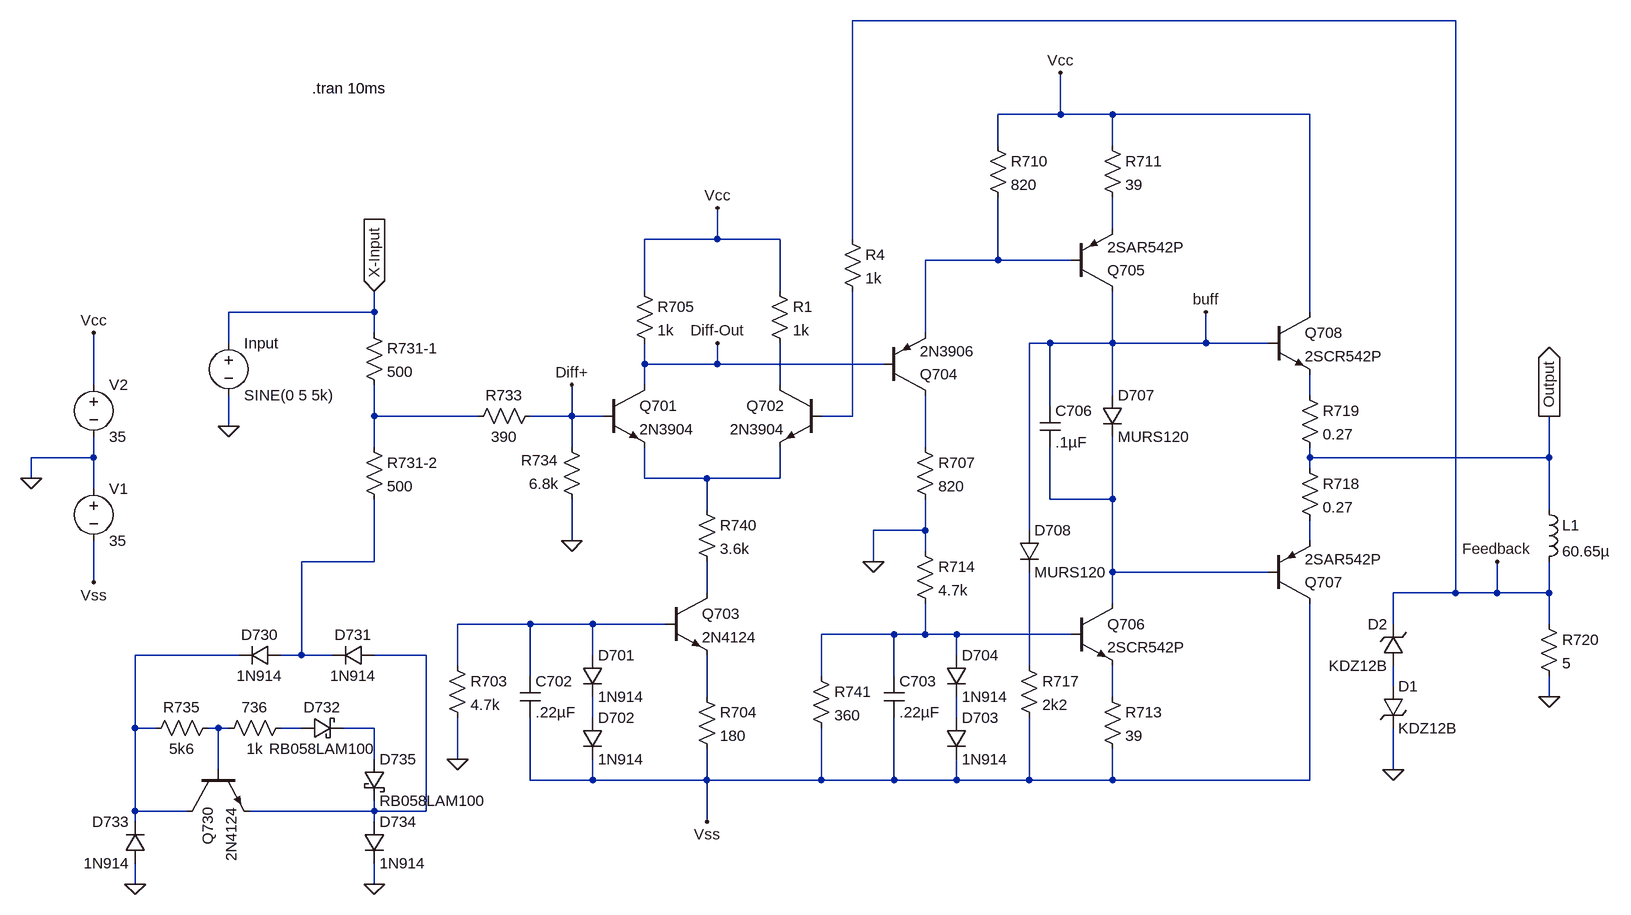
[diagram p0: schematic Atari Deflector X.asc]
Atari Deflector X.asc, the LTspice schematic file:
Version 4
SHEET 1 1880 912
WIRE 1632 -432 704 -432
WIRE 1024 -288 1024 -352
WIRE 1024 -288 928 -288
WIRE 1104 -288 1024 -288
WIRE 1408 -288 1104 -288
WIRE 928 -240 928 -288
WIRE 1104 -240 1104 -288
WIRE 1104 -112 1104 -160
WIRE 496 -96 496 -144
WIRE 496 -96 384 -96
WIRE 592 -96 496 -96
WIRE 704 -96 704 -432
WIRE 928 -64 928 -160
WIRE 928 -64 816 -64
WIRE 1040 -64 928 -64
WIRE 384 -16 384 -96
WIRE 592 -16 592 -96
WIRE -32 16 -32 -16
WIRE -32 16 -256 16
WIRE 1408 16 1408 -288
WIRE -32 48 -32 16
WIRE 816 48 816 -64
WIRE -256 64 -256 16
WIRE 1008 64 976 64
WIRE 1104 64 1104 -16
WIRE 1104 64 1008 64
WIRE 1248 64 1248 16
WIRE 1248 64 1104 64
WIRE 1344 64 1248 64
WIRE 384 96 384 64
WIRE 496 96 496 64
WIRE 496 96 384 96
WIRE 752 96 496 96
WIRE -464 128 -464 48
WIRE 384 128 384 96
WIRE 592 128 592 64
WIRE 1104 144 1104 64
WIRE 1408 144 1408 112
WIRE 1008 160 1008 64
WIRE -32 176 -32 128
WIRE 128 176 -32 176
WIRE 272 176 272 128
WIRE 272 176 208 176
WIRE 320 176 272 176
WIRE 704 176 704 -16
WIRE 704 176 656 176
WIRE -256 192 -256 144
WIRE -32 224 -32 176
WIRE 272 224 272 176
WIRE 816 224 816 144
WIRE -464 240 -464 208
WIRE -464 240 -560 240
WIRE 1408 240 1408 224
WIRE 1776 240 1776 176
WIRE 1776 240 1408 240
WIRE 1408 256 1408 240
WIRE -560 272 -560 240
WIRE 384 272 384 224
WIRE 480 272 384 272
WIRE 592 272 592 224
WIRE 592 272 480 272
WIRE -464 288 -464 240
WIRE 1008 304 1008 224
WIRE 1104 304 1104 208
WIRE 1104 304 1008 304
WIRE 480 320 480 272
WIRE 1776 320 1776 240
WIRE 816 352 816 304
WIRE 816 352 736 352
WIRE 976 352 976 64
WIRE 272 368 272 304
WIRE 1408 368 1408 336
WIRE 816 384 816 352
WIRE -32 400 -32 304
WIRE -32 400 -144 400
WIRE 736 400 736 352
WIRE 1104 416 1104 304
WIRE 1344 416 1104 416
WIRE -464 432 -464 368
WIRE 480 448 480 400
WIRE 1632 448 1632 -432
WIRE 1632 448 1536 448
WIRE 1696 448 1696 400
WIRE 1696 448 1632 448
WIRE 1776 448 1776 400
WIRE 1776 448 1696 448
WIRE 1104 464 1104 416
WIRE 208 496 96 496
WIRE 304 496 208 496
WIRE 416 496 304 496
WIRE 1536 496 1536 448
WIRE 1776 496 1776 448
WIRE 768 512 656 512
WIRE 816 512 816 464
WIRE 816 512 768 512
WIRE 864 512 816 512
WIRE 1040 512 864 512
WIRE -240 544 -400 544
WIRE -144 544 -144 400
WIRE -144 544 -176 544
WIRE -96 544 -144 544
WIRE 48 544 -32 544
WIRE 304 544 304 496
WIRE 864 544 864 512
WIRE 96 560 96 496
WIRE 976 560 976 416
WIRE 208 576 208 496
WIRE 656 576 656 512
WIRE 768 576 768 512
WIRE 1536 592 1536 560
WIRE 480 608 480 544
WIRE 1104 608 1104 560
WIRE 1776 608 1776 576
WIRE 304 640 304 608
WIRE 864 640 864 608
WIRE -400 656 -400 544
WIRE -368 656 -400 656
WIRE -272 656 -288 656
WIRE -256 656 -272 656
WIRE -144 656 -176 656
WIRE -32 656 -80 656
WIRE -32 704 -32 656
WIRE 96 704 96 640
WIRE -272 720 -272 656
WIRE 1536 720 1536 656
WIRE 208 736 208 640
WIRE 304 736 304 704
WIRE 304 736 208 736
WIRE 480 736 480 688
WIRE 480 736 304 736
WIRE 656 736 656 656
WIRE 656 736 480 736
WIRE 768 736 768 640
WIRE 768 736 656 736
WIRE 864 736 864 704
WIRE 864 736 768 736
WIRE 976 736 976 640
WIRE 976 736 864 736
WIRE 1104 736 1104 688
WIRE 1104 736 976 736
WIRE 1408 736 1408 464
WIRE 1408 736 1104 736
WIRE -400 784 -400 656
WIRE -320 784 -400 784
WIRE -32 784 -32 768
WIRE -32 784 -224 784
WIRE 48 784 48 544
WIRE 48 784 -32 784
WIRE -400 800 -400 784
WIRE -32 800 -32 784
WIRE 480 800 480 736
WIRE -400 896 -400 864
WIRE -32 896 -32 864
FLAG -560 272 0
FLAG -464 48 Vcc
FLAG -464 432 Vss
FLAG 480 800 Vss
FLAG 96 704 0
FLAG 496 -144 Vcc
FLAG 272 368 0
FLAG -32 -16 X-Input
IOPIN -32 -16 In
FLAG -400 896 0
FLAG -32 896 0
FLAG 736 400 0
FLAG 1024 -352 Vcc
FLAG 1776 608 0
FLAG 1776 176 Output
IOPIN 1776 176 Out
FLAG -256 192 0
FLAG 272 128 Diff+
FLAG 496 64 Diff-Out
FLAG 1248 16 buff
FLAG 1536 720 0
FLAG 1696 400 Feedback
SYMBOL npn 320 128 R0
SYMATTR InstName Q701
SYMATTR Value 2N3904
SYMBOL npn 656 128 M0
SYMATTR InstName Q702
SYMATTR Value 2N3904
SYMBOL npn 416 448 R0
SYMATTR InstName Q703
SYMATTR Value 2N4124
SYMBOL res 464 304 R0
SYMATTR InstName R740
SYMATTR Value 3.6k
SYMBOL res 464 592 R0
SYMATTR InstName R704
SYMATTR Value 180
SYMBOL voltage -464 272 R0
SYMATTR InstName V1
SYMATTR Value 35
SYMBOL voltage -464 112 R0
SYMATTR InstName V2
SYMATTR Value 35
SYMBOL diode 288 544 R0
SYMATTR InstName D701
SYMATTR Value 1N914
SYMBOL diode 288 640 R0
SYMATTR InstName D702
SYMATTR Value 1N914
SYMBOL res 80 544 R0
SYMATTR InstName R703
SYMATTR Value 4.7k
SYMBOL cap 192 576 R0
SYMATTR InstName C702
SYMATTR Value .22µF
SYMBOL res 368 -32 R0
SYMATTR InstName R705
SYMATTR Value 1k
SYMBOL res 576 -32 R0
SYMATTR InstName R1
SYMATTR Value 1k
SYMBOL res 288 320 R180
WINDOW 0 36 76 Left 2
WINDOW 3 36 40 Left 2
SYMATTR InstName R734
SYMATTR Value 6.8k
SYMBOL res 224 160 R90
WINDOW 0 0 56 VBottom 2
WINDOW 3 32 56 VTop 2
SYMATTR InstName R733
SYMATTR Value 390
SYMBOL res -48 32 R0
SYMATTR InstName R731-1
SYMATTR Value 500
SYMBOL res -48 208 R0
SYMATTR InstName R731-2
SYMATTR Value 500
SYMBOL diode -176 528 R90
WINDOW 0 0 32 VBottom 2
WINDOW 3 32 32 VTop 2
SYMATTR InstName D730
SYMATTR Value 1N914
SYMBOL diode -32 528 R90
WINDOW 0 0 32 VBottom 2
WINDOW 3 32 32 VTop 2
SYMATTR InstName D731
SYMATTR Value 1N914
SYMBOL diode -384 864 R180
WINDOW 0 24 64 Left 2
WINDOW 3 24 0 Left 2
SYMATTR InstName D733
SYMATTR Value 1N914
SYMBOL diode -48 800 R0
SYMATTR InstName D734
SYMATTR Value 1N914
SYMBOL schottky -144 672 R270
WINDOW 0 32 32 VTop 2
WINDOW 3 0 32 VBottom 2
SYMATTR InstName D732
SYMATTR Value RB058LAM100
SYMATTR Description Diode
SYMATTR Type diode
SYMBOL schottky -48 704 R0
SYMATTR InstName D735
SYMATTR Value RB058LAM100
SYMATTR Description Diode
SYMATTR Type diode
SYMBOL npn -320 720 M90
SYMATTR InstName Q730
SYMATTR Value 2N4124
SYMBOL res -272 640 R90
WINDOW 0 0 56 VBottom 2
WINDOW 3 32 56 VTop 2
SYMATTR InstName R735
SYMATTR Value 5k6
SYMBOL res -160 640 R90
WINDOW 0 0 56 VBottom 2
WINDOW 3 32 56 VTop 2
SYMATTR InstName 736
SYMATTR Value 1k
SYMBOL pnp 752 144 M180
SYMATTR InstName Q704
SYMATTR Value 2N3906
SYMBOL res 800 208 R0
SYMATTR InstName R707
SYMATTR Value 820
SYMBOL pnp 1040 -16 M180
SYMATTR InstName Q705
SYMATTR Value 2SAR542P
SYMBOL res 912 -256 R0
SYMATTR InstName R710
SYMATTR Value 820
SYMBOL res 1088 -256 R0
SYMATTR InstName R711
SYMATTR Value 39
SYMBOL diode 960 352 R0
SYMATTR InstName D708
SYMATTR Value MURS120
SYMBOL diode 1088 144 R0
SYMATTR InstName D707
SYMATTR Value MURS120
SYMBOL diode 848 544 R0
SYMATTR InstName D704
SYMATTR Value 1N914
SYMBOL diode 848 640 R0
SYMATTR InstName D703
SYMATTR Value 1N914
SYMBOL res 640 560 R0
SYMATTR InstName R741
SYMATTR Value 360
SYMBOL cap 752 576 R0
SYMATTR InstName C703
SYMATTR Value .22µF
SYMBOL npn 1040 464 R0
SYMATTR InstName Q706
SYMATTR Value 2SCR542P
SYMBOL res 960 544 R0
SYMATTR InstName R717
SYMATTR Value 2k2
SYMBOL cap 992 160 R0
SYMATTR InstName C706
SYMATTR Value .1µF
SYMBOL res 1088 592 R0
SYMATTR InstName R713
SYMATTR Value 39
SYMBOL pnp 1344 464 M180
SYMATTR InstName Q707
SYMATTR Value 2SAR542P
SYMBOL npn 1344 16 R0
SYMATTR InstName Q708
SYMATTR Value 2SCR542P
SYMBOL res 1392 128 R0
SYMATTR InstName R719
SYMATTR Value 0.27
SYMBOL res 1392 240 R0
SYMATTR InstName R718
SYMATTR Value 0.27
SYMBOL ind 1760 304 R0
SYMATTR InstName L1
SYMATTR Value 60.65µ
SYMBOL res 1760 480 R0
SYMATTR InstName R720
SYMATTR Value 5
SYMBOL voltage -256 48 R0
SYMATTR InstName Input
SYMATTR Value SINE(0 5 5k)
SYMBOL zener 1520 592 R0
SYMATTR InstName D1
SYMATTR Value KDZ12B
SYMATTR Description Diode
SYMATTR Type diode
SYMBOL zener 1552 560 R180
WINDOW 0 24 64 Left 2
WINDOW 3 24 0 Left 2
SYMATTR InstName D2
SYMATTR Value KDZ12B
SYMATTR Description Diode
SYMATTR Type diode
SYMBOL res 688 -112 R0
SYMATTR InstName R4
SYMATTR Value 1k
SYMBOL res 800 368 R0
SYMATTR InstName R714
SYMATTR Value 4.7k
TEXT -128 -328 Left 2 !.tran 10ms

The netlist it stands for:
* Atari Deflector X.asc
Q701 Diff-Out Diff+ N008 0 2N3904
Q702 N003 N006 N008 0 2N3904
Q703 N012 N013 N019 0 2N4124
R740 N008 N012 3.6k
R704 N019 Vss 180
V1 0 Vss 35
V2 Vcc 0 35
D701 N013 N021 1N914
D702 N021 Vss 1N914
R703 N013 0 4.7k
C702 N013 Vss .22µF
R705 Vcc Diff-Out 1k
R1 Vcc N003 1k
R734 0 Diff+ 6.8k
R733 Diff+ N005 390
R731-1 X-Input N005 500
R731-2 N005 N011 500
D730 N011 N015 1N914
D731 N016 N011 1N914
D733 0 N015 1N914
D734 N016 0 1N914
D732 N024 N025 RB058LAM100
D735 N025 N016 RB058LAM100
Q730 N015 N023 N016 0 2N4124
R735 N023 N015 5k6
R§736 N024 N023 1k
Q704 N007 Diff-Out N002 0 2N3906
R707 N007 0 820
Q705 buff N002 N001 0 2SAR542P
R710 Vcc N002 820
R711 Vcc N001 39
D708 buff N017 MURS120
D707 buff N009 MURS120
D704 N014 N022 1N914
D703 N022 Vss 1N914
R741 N014 Vss 360
C703 N014 Vss .22µF
Q706 N009 N014 N020 0 2SCR542P
R717 N017 Vss 2k2
C706 buff N009 .1µF
R713 N020 Vss 39
Q707 Vss N009 N010 0 2SAR542P
Q708 Vcc buff N004 0 2SCR542P
R719 N004 Output 0.27
R718 Output N010 0.27
L1 Output Feedback 60.65µ
R720 Feedback 0 5
V§Input X-Input 0 SINE(0 5 5k)
D1 N018 0 KDZ12B
D2 N018 Feedback KDZ12B
R4 Feedback N006 1k
R714 0 N014 4.7k
.model D D
.lib standard.dio
.model NPN NPN
.model PNP PNP
.lib standard.bjt
.tran 10ms
.backanno
.end